# Altium schematic sheet display.SchDoc
size A4; SheetNumber: 4; SheetTotal: 4
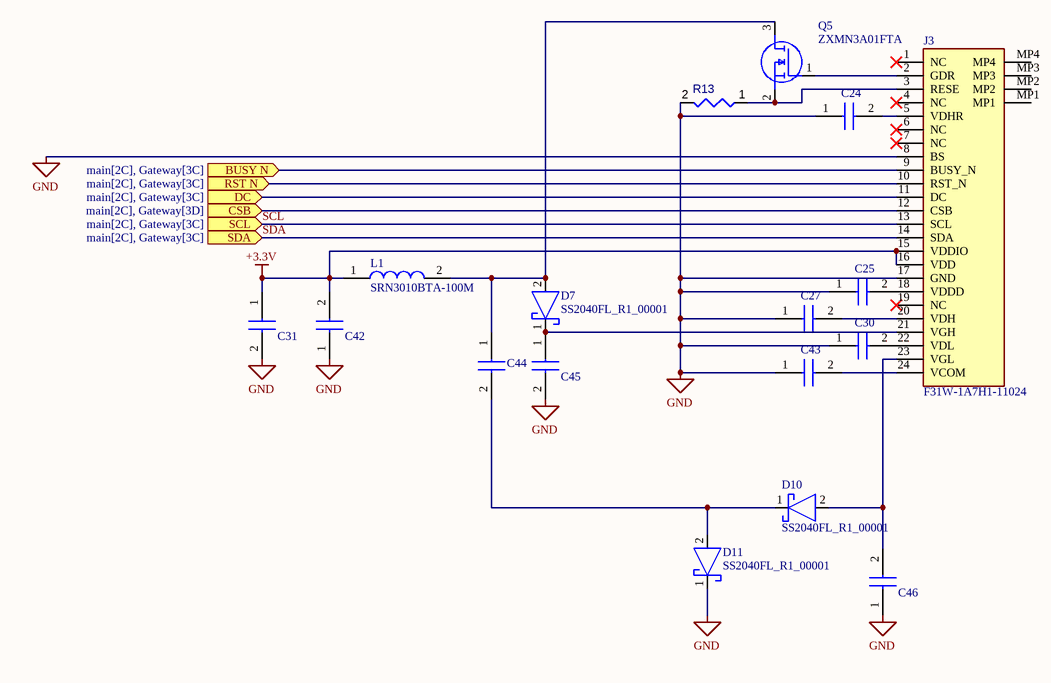
[diagram p0: display.SchDoc]

## Parts
C24  CL21Y105KCYVPNE  [CAPC2012X145N]  (value not drawn)
C25  CL21Y105KCYVPNE  [CAPC2012X145N]  (value not drawn)
C27  CL21Y105KCYVPNE  [CAPC2012X145N]  (value not drawn)
C30  CL21Y105KCYVPNE  [CAPC2012X145N]  (value not drawn)
C31  C1005X5R1E104K050BC  [CAPC1005X55N]  (value not drawn)
C42  CL21Y105KCYVPNE  [CAPC2012X145N]  (value not drawn)
C43  CL21Y105KCYVPNE  [CAPC2012X145N]  (value not drawn)
C44  KAM32LR72A475KU  [CAPC3225X94N]  (value not drawn)
C45  CL21Y105KCYVPNE  [CAPC2012X145N]  (value not drawn)
C46  CL21Y105KCYVPNE  [CAPC2012X145N]  (value not drawn)
D7  SS2040FL_R1_00001  [SODFL3618X110N]
D10  SS2040FL_R1_00001  [SODFL3618X110N]
D11  SS2040FL_R1_00001  [SODFL3618X110N]
J3  F31W-1A7H1-11024  [F31W1A7H111024]
L1  SRN3010BTA-100M  [SRN3010BTA100M]
Q5  ZXMN3A01FTA  [SOT96P240X110-3N]
R13  PE1206FRF070R47L  [PE1206FRF070R47L-Footprint-1]  (value not drawn)

## Ports
BUSY N (in, see main[2C], Gateway[3C]), CSB (in, see main[2C], Gateway[3D]), DC (in, see main[2C], Gateway[3C]), RST N (in, see main[2C], Gateway[3C]), SCL (in, see main[2C], Gateway[3C]), SDA (in, see main[2C], Gateway[3C])

## Nets
+3.3V: C31.1 C42.2 J3.15(VDDIO) J3.16(VDD) L1.1
GND: C24.1 C25.1 C27.1 C30.1 C31.2 C42.1 C43.1 C45.2 C46.1 D11.1(K) J3.8(BS) J3.17(GND) R13.2
BUSY N: J3.9(BUSY_N) ; port BUSY N
CSB: J3.12(CSB) ; port CSB
DC: J3.11(DC) ; port DC
RST N: J3.10(RST_N) ; port RST N
SCL: J3.13(SCL) ; port SCL
SDA: J3.14(SDA) ; port SDA
NetC24_2: C24.2 J3.5(VDHR)
NetC25_2: C25.2 J3.18(VDDD)
NetC27_2: C27.2 J3.20(VDH)
NetC30_2: C30.2 J3.22(VDL)
NetC43_2: C43.2 J3.24(VCOM)
NetC44_1: C44.1 D7.2(A) L1.2 Q5.3(D)
NetC44_2: C44.2 D10.1(K) D11.2(A)
NetC45_1: C45.1 D7.1(K) J3.21(VGH)
NetC46_2: C46.2 D10.2(A) J3.23(VGL)
NetJ3_2: J3.2(GDR) Q5.1(G)
NetJ3_3: J3.3(RESE) Q5.2(S) R13.1

Not connected (* = marked no-connect by the designer): J3 1(NC)* 4(NC)* 6(NC)* 7(NC)* 19(NC)* MP1 MP2 MP3 MP4

## Library data of the parts
C24 C25 C27 C30 C42 C43 C45 C46 = CL21Y105KCYVPNE: Capacitor; Manufacturer_Name: SAMSUNG; Datasheet Link: https://product.samsungsem.com/mlcc/basic-search.do?partNumber=CL21Y105KCYVPN; Height: 1.45mm; Manufacturer_Part_Number: CL21Y105KCYVPNE
C31 = C1005X5R1E104K050BC: Capacitor; Manufacturer_Name: TDK; Datasheet Link: https://product.tdk.com/info/en/catalog/datasheets/mlcc_commercial_midvoltage_en.pdf; Height: 0.55mm; Manufacturer_Part_Number: C1005X5R1E104K050BC; Mouser Part Number: 810-C1005X5R1E104K; Mouser Price/Stock: https://www.mouser.co.uk/ProductDetail/TDK/C1005X5R1E104K050BC?qs=dfay7wIA1uGgFjZlp3mTxQ%3D%3D; Arrow Part Number: C1005X5R1E104K050BC; Arrow Price/Stock: https://www.arrow.com/en/products/c1005x5r1e104k050bc/tdk
C44 = KAM32LR72A475KU: Capacitor 4.7u; Manufacturer_Name: Kyocera AVX; Datasheet Link: https://www.mouser.com/datasheet/2/40/AutoMLCCKAM-3216307.pdf; Height: 0.94mm; Manufacturer_Part_Number: KAM32LR72A475KU; Mouser Part Number: 581-KAM32LR72A475KU; Mouser Price/Stock: https://www.mouser.co.uk/ProductDetail/KYOCERA-AVX/KAM32LR72A475KU?qs=Jm2GQyTW%2FbjYtp2QXhBrlg%3D%3D; Arrow Part Number: KAM32LR72A475KU; Arrow Price/Stock: https://www.arrow.com/en/products/kam32lr72a475ku/avx?region=europe
D7 D10 D11 = SS2040FL_R1_00001: Schottky Diode; Manufacturer_Name: PANJIT; Datasheet Link: https://4donline.ihs.com/images/VipMasterIC/IC/PNJI/PNJI-S-A0003671102/PNJI-S-A0003671102-1.pdf?hkey=EF798316E3902B6ED9A73243A3159BB0; Height: 1.1mm; Manufacturer_Part_Number: SS2040FL_R1_00001; Mouser Part Number: 241-SS2040FLR100001; Mouser Price/Stock: https://www.mouser.co.uk/ProductDetail/Panjit/SS2040FL_R1_00001?qs=sPbYRqrBIVmCtoceM2y4%252BA%3D%3D
J3 = F31W-1A7H1-11024: Connector; Manufacturer_Name: Amphenol; Datasheet Link: https://cdn.amphenol-cs.com/media/wysiwyg/files/drawing/f31z-f31w.pdf; Height: 4.45mm; Manufacturer_Part_Number: F31W-1A7H1-11024; Mouser Part Number: 649-F31W-1A7H1-11024; Mouser Price/Stock: https://www.mouser.co.uk/ProductDetail/Amphenol-Aorora/F31W-1A7H1-11024?qs=xZ%2FP%252Ba9zWqa0iq%252BjDeduug%3D%3D
L1 = SRN3010BTA-100M: Inductor; Manufacturer_Name: Bourns; Datasheet Link: https://www.bourns.com/docs/Product-Datasheets/SRN3010BTA.pdf; Height: 1mm; Manufacturer_Part_Number: SRN3010BTA-100M; Mouser Part Number: 652-SRN3010BTA-100M; Mouser Price/Stock: https://www.mouser.co.uk/ProductDetail/Bourns/SRN3010BTA-100M?qs=Imq1NPwxi75hQQCe%2FkNzJA%3D%3D
Q5 = ZXMN3A01FTA: MOSFET (N-Channel); Manufacturer_Name: Diodes Incorporated; Datasheet Link: https://www.diodes.com//assets/Datasheets/ZXMN3A01F.pdf; Height: 1.1mm; Manufacturer_Part_Number: ZXMN3A01FTA; Mouser Part Number: 522-ZXMN3A01FTA; Mouser Price/Stock: https://www.mouser.co.uk/ProductDetail/Diodes-Incorporated/ZXMN3A01FTA?qs=zhx2xqPtQQzkOZ3rSVbgbA%3D%3D; Arrow Part Number: ZXMN3A01FTA; Arrow Price/Stock: https://www.arrow.com/en/products/zxmn3a01fta/diodes-incorporated?region=europe
R13 = CMP-009-00177-1